# EAGLE schematic Domino (EAGLE 6.5.0)
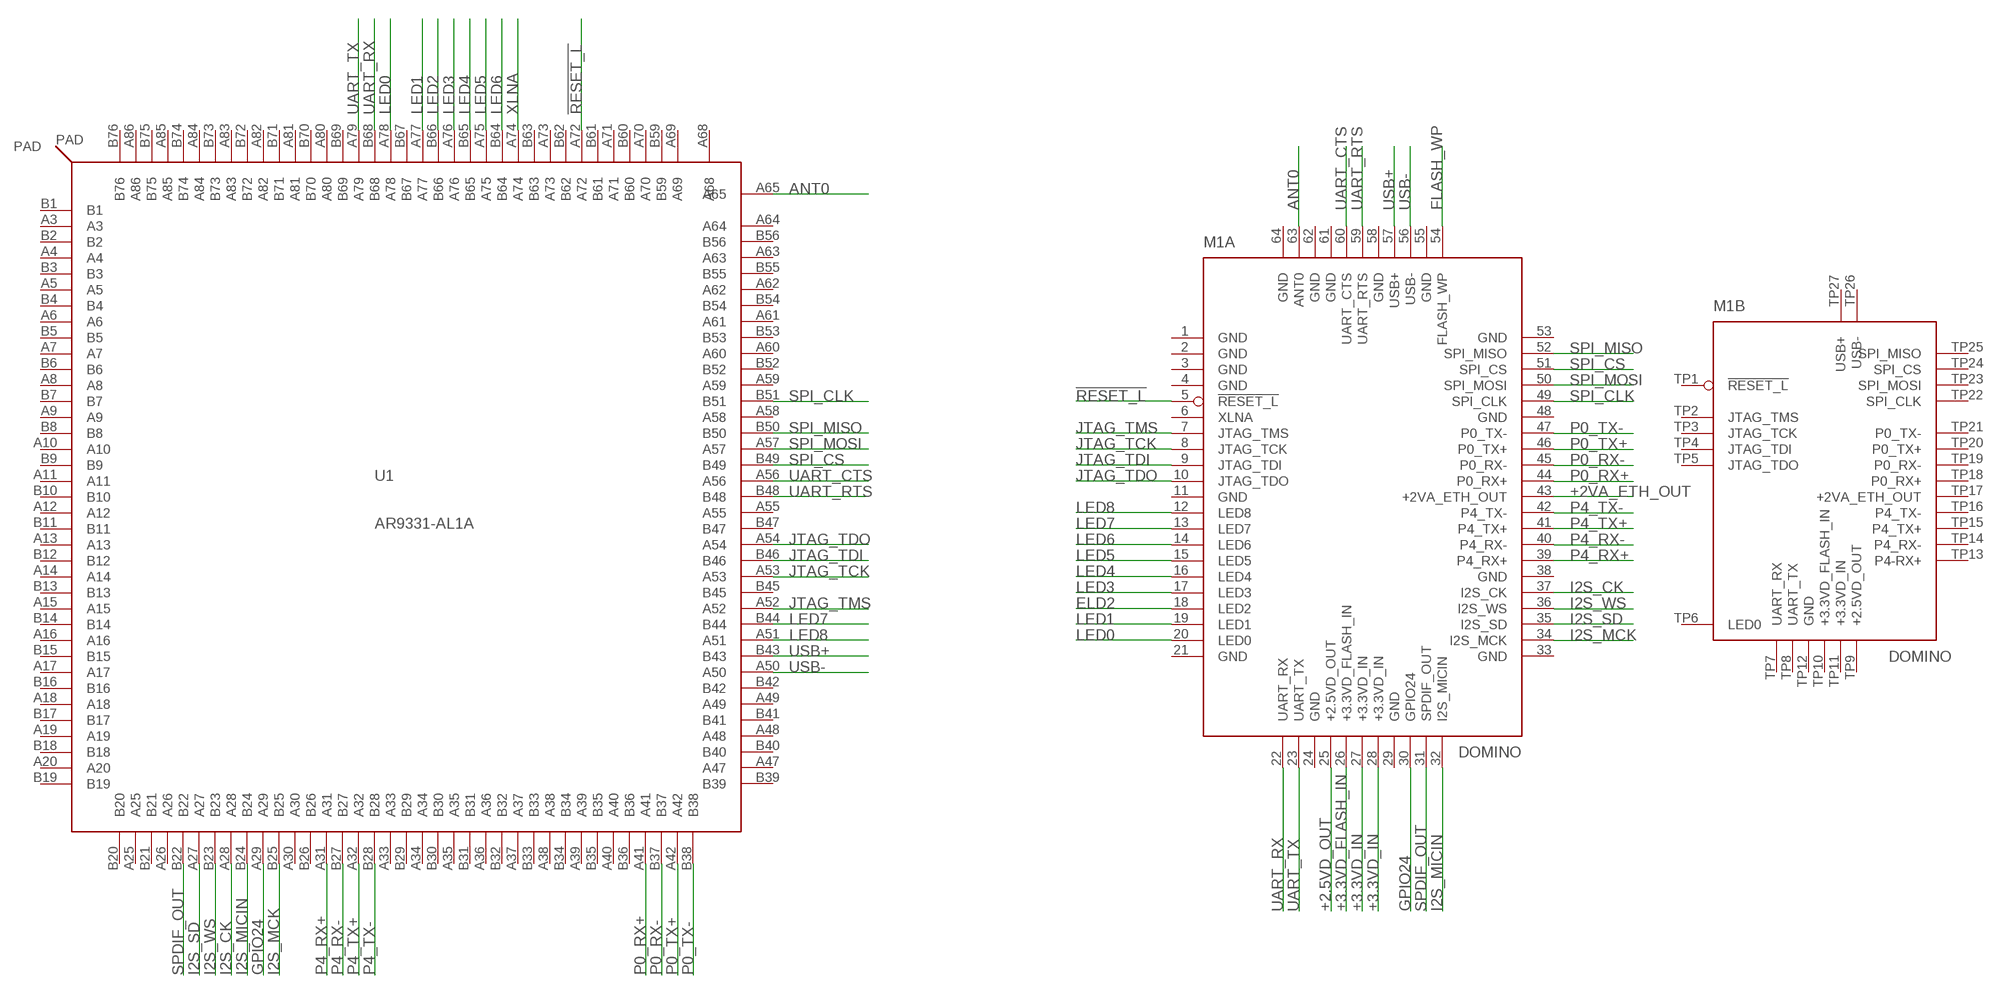
[diagram p0: schematic, sheet 1]

## Parts
M1  DOMINO  [DOMINO]
U1  AR9331-AL1A  [DRMLF164]

## Nets
!RESET_L: M1.5(A:!RESET_L) U1.A72
+2.5VD_OUT: M1.25(A:+2.5VD_OUT)
+2VA_ETH_OUT: M1.43(A:+2VA_ETH_OUT)
+3.3VD_FLASH_IN: M1.26(A:+3.3VD_FLASH_IN)
+3.3VD_IN: M1.27(A:+3.3VD_IN) M1.28(A:+3.3VD_IN)
ANT0: M1.63(A:ANT0) U1.A65
ELD2: M1.18(A:LED2)
FLASH_WP: M1.54(A:FLASH_WP)
GPIO24: M1.30(A:GPIO24) U1.A29
I2S_CK: M1.37(A:I2S_CK) U1.A28
I2S_MCK: M1.34(A:I2S_MCK) U1.B25
I2S_MICIN: M1.32(A:I2S_MICIN) U1.B24
I2S_SD: M1.35(A:I2S_SD) U1.A27
I2S_WS: M1.36(A:I2S_WS) U1.B23
JTAG_TCK: M1.8(A:JTAG_TCK) U1.A53
JTAG_TDI: M1.9(A:JTAG_TDI) U1.B46
JTAG_TDO: M1.10(A:JTAG_TDO) U1.A54
JTAG_TMS: M1.7(A:JTAG_TMS) U1.A52
LED0: M1.20(A:LED0) U1.A78
LED1: M1.19(A:LED1) U1.A77
LED2: U1.B66
LED3: M1.17(A:LED3) U1.A76
LED4: M1.16(A:LED4) U1.B65
LED5: M1.15(A:LED5) U1.A75
LED6: M1.14(A:LED6) U1.B64
LED7: M1.13(A:LED7) U1.B44
LED8: M1.12(A:LED8) U1.A51
P0_RX+: M1.44(A:P0_RX+) U1.A41
P0_RX-: M1.45(A:P0_RX-) U1.B37
P0_TX+: M1.46(A:P0_TX+) U1.A42
P0_TX-: M1.47(A:P0_TX-) U1.B38
P4_RX+: M1.39(A:P4_RX+) U1.A31
P4_RX-: M1.40(A:P4_RX-) U1.B27
P4_TX+: M1.41(A:P4_TX+) U1.A32
P4_TX-: M1.42(A:P4_TX-) U1.B28
SPDIF_OUT: M1.31(A:SPDIF_OUT) U1.B22
SPI_CLK: M1.49(A:SPI_CLK) U1.B51
SPI_CS: M1.51(A:SPI_CS) U1.B49
SPI_MISO: M1.52(A:SPI_MISO) U1.B50
SPI_MOSI: M1.50(A:SPI_MOSI) U1.A57
UART_CTS: M1.60(A:UART_CTS) U1.A56
UART_RTS: M1.59(A:UART_RTS) U1.B48
UART_RX: M1.22(A:UART_RX) U1.B68
UART_TX: M1.23(A:UART_TX) U1.A79
USB+: M1.57(A:USB+) U1.B43
USB-: M1.56(A:USB-) U1.A50
XLNA: U1.A74
Unconnected: M1.1(A:GND) M1.2(A:GND) M1.3(A:GND) M1.4(A:GND) M1.6(A:XLNA) M1.11(A:GND) M1.21(A:GND) M1.24(A:GND) M1.29(A:GND) M1.33(A:GND) M1.38(A:GND) M1.48(A:GND) M1.53(A:GND) M1.55(A:GND) M1.58(A:GND) M1.61(A:GND) M1.62(A:GND) M1.64(A:GND) M1.TP1(B:!RESET_L) M1.TP2(B:JTAG_TMS) M1.TP3(B:JTAG_TCK) M1.TP4(B:JTAG_TDI) M1.TP5(B:JTAG_TDO) M1.TP6(B:LED0) M1.TP7(B:UART_RX) M1.TP8(B:UART_TX) M1.TP10(B:+3.3VD_FLASH_IN) M1.TP11(B:+3.3VD_IN) M1.TP12(B:GND) M1.TP13(B:P4-RX+) M1.TP14(B:P4_RX-) M1.TP15(B:P4_TX+) M1.TP16(B:P4_TX-) M1.TP18(B:P0_RX+) M1.TP19(B:P0_RX-) M1.TP20(B:P0_TX+) M1.TP21(B:P0_TX-) M1.TP22(B:SPI_CLK) M1.TP23(B:SPI_MOSI) M1.TP24(B:SPI_CS) M1.TP25(B:SPI_MISO) M1.TP26(B:USB-) M1.TP27(B:USB+) U1.A3 U1.A4 U1.A5 U1.A6 U1.A7 U1.A8 U1.A9 U1.A10 U1.A11 U1.A12 U1.A13 U1.A14 U1.A15 U1.A16 U1.A17 U1.A18 U1.A19 U1.A20 U1.A25 U1.A26 U1.A30 U1.A33 U1.A34 U1.A35 U1.A36 U1.A37 U1.A38 U1.A39 U1.A40 U1.A47 U1.A48 U1.A49 U1.A55 U1.A58 U1.A59 U1.A60 U1.A61 U1.A62 U1.A63 U1.A64 U1.A68 U1.A69 U1.A70 U1.A71 U1.A73 U1.A80 U1.A81 U1.A82 U1.A83 U1.A84 U1.A85 U1.A86 U1.B1 U1.B2 U1.B3 U1.B4 U1.B5 U1.B6 U1.B7 U1.B8 U1.B9 U1.B10 U1.B11 U1.B12 U1.B13 U1.B14 U1.B15 U1.B16 U1.B17 U1.B18 U1.B19 U1.B20 U1.B21 U1.B26 U1.B29 U1.B30 U1.B31 U1.B32 U1.B33 U1.B34 U1.B35 U1.B36 U1.B39 U1.B40 U1.B41 U1.B42 U1.B45 U1.B47 U1.B52 U1.B53 U1.B54 U1.B55 U1.B56 U1.B59 U1.B60 U1.B61 U1.B62 U1.B63 U1.B67 U1.B69 U1.B70 U1.B71 U1.B72 U1.B73 U1.B74 U1.B75 U1.B76 U1.PAD

## Power pins joined to a net without a drawn wire
+2.5VD_OUT: M1.TP9(B:+2.5VD_OUT)
+2VA_ETH_OUT: M1.TP17(B:+2VA_ETH_OUT)

## Library data of the parts
M1 = Domino:DOMINO: GL-Connect Domino WiFi Module
U1 = Domino:AR9331-: Atheros AR9331 SoC Copyright © 2012, Michel Stempin, All rights reserved Licenced under Creative Commons CC BY-SA 3.0 <http://creativecommons.org/licenses/by-sa/3.0/deed.en> license.